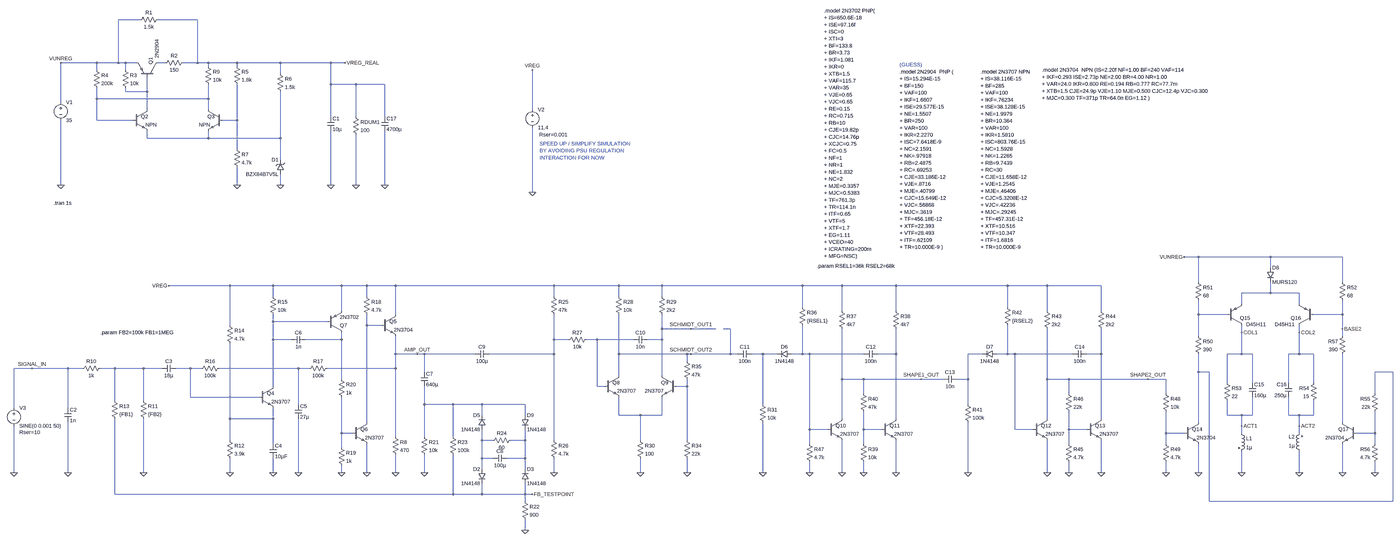
[diagram p0: schematic Balantron signal.asc, whole sheet]
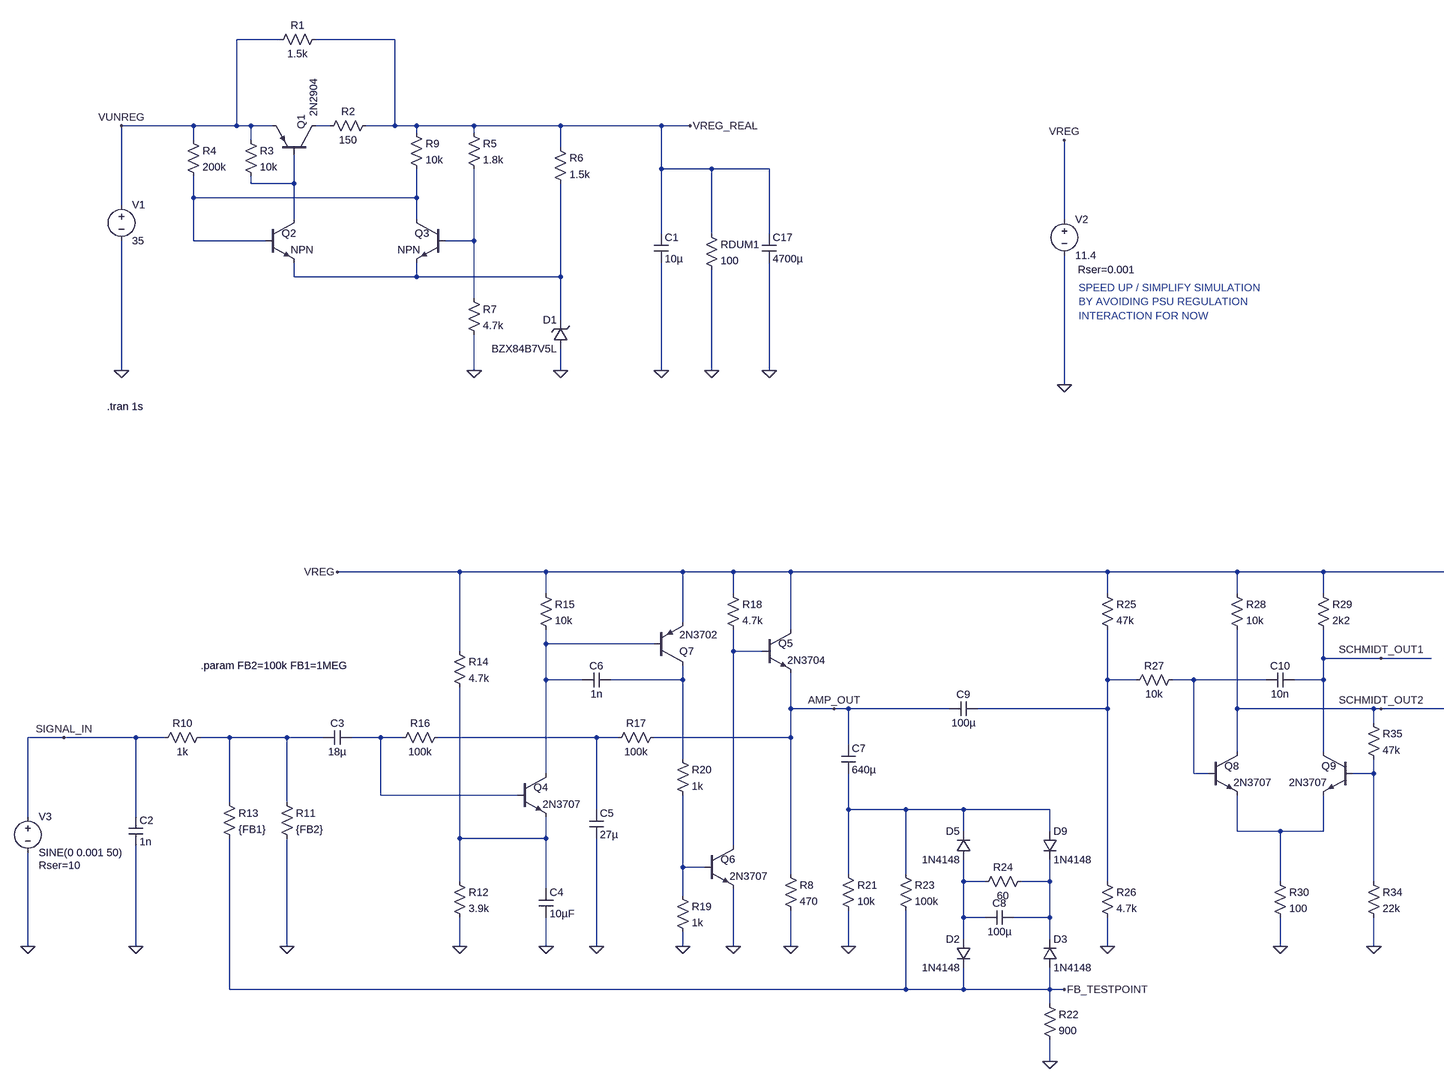
[diagram p1: schematic Balantron signal.asc, part, row 1 of 1, column 1 of 2]
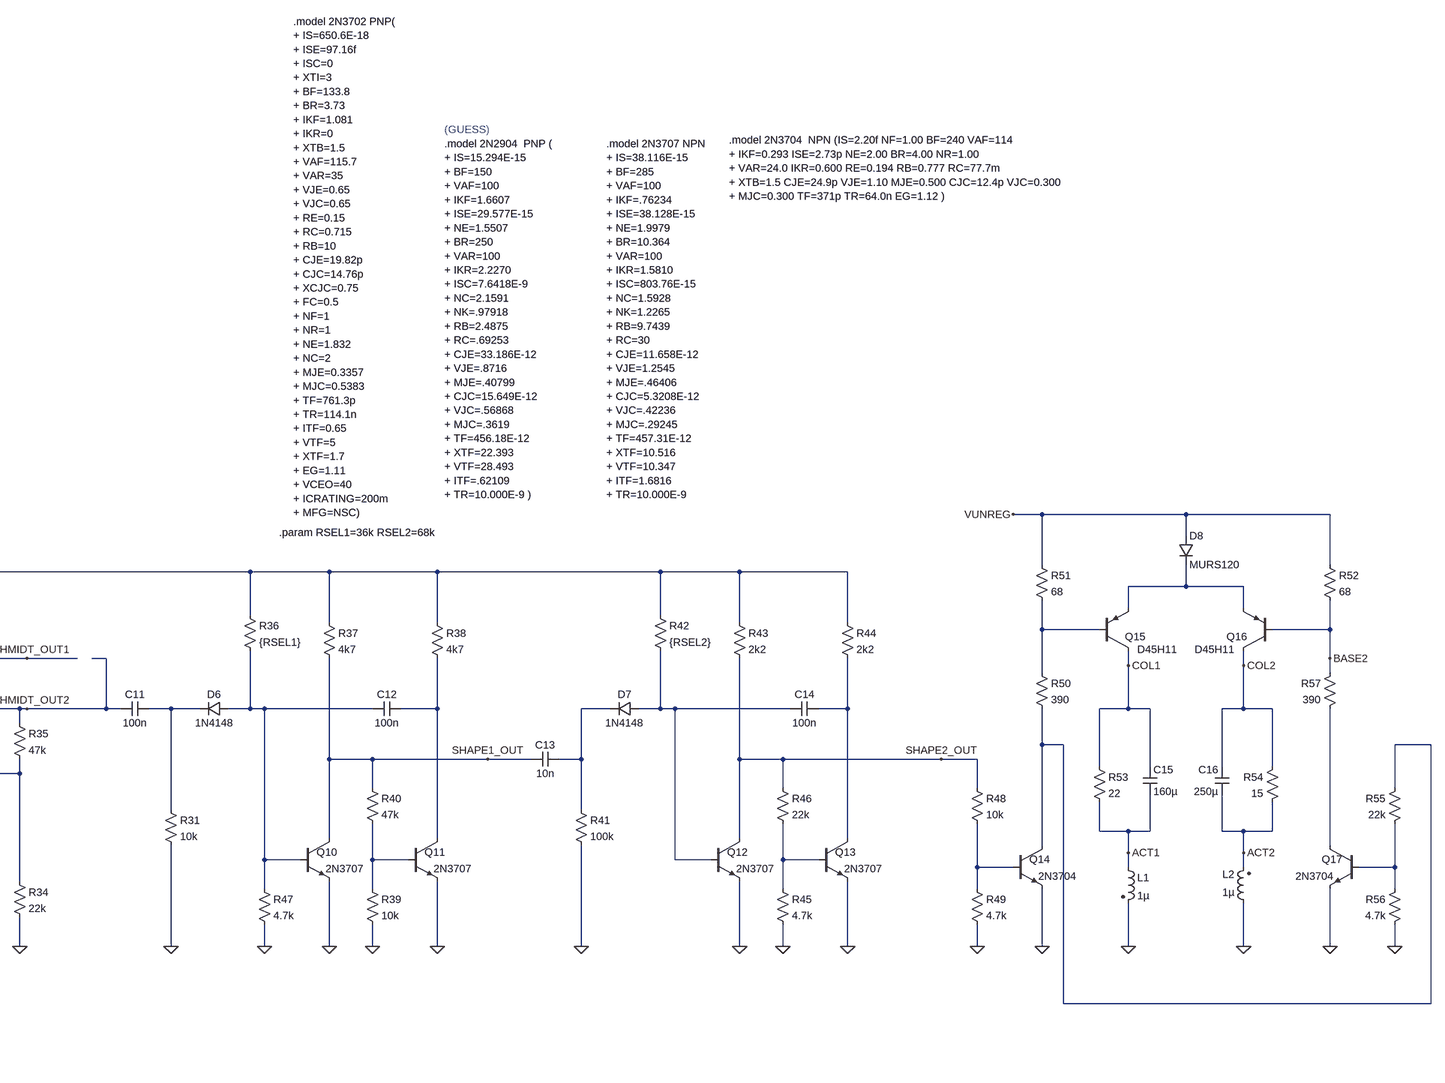
[diagram p2: schematic Balantron signal.asc, part, row 1 of 1, column 2 of 2]
Balantron signal.asc, the LTspice schematic file:
Version 4
SHEET 1 33348 1964
WIRE -432 -576 -528 -576
WIRE -176 -576 -352 -576
WIRE -624 -384 -784 -384
WIRE -528 -384 -528 -576
WIRE -528 -384 -624 -384
WIRE -496 -384 -528 -384
WIRE -448 -384 -496 -384
WIRE -320 -384 -352 -384
WIRE -176 -384 -176 -576
WIRE -176 -384 -240 -384
WIRE -128 -384 -176 -384
WIRE 0 -384 -128 -384
WIRE 192 -384 0 -384
WIRE 416 -384 192 -384
WIRE 480 -384 416 -384
WIRE -128 -368 -128 -384
WIRE 0 -368 0 -384
WIRE -624 -352 -624 -384
WIRE -496 -352 -496 -384
WIRE 192 -336 192 -384
WIRE 416 -288 416 -384
WIRE 528 -288 416 -288
WIRE 656 -288 528 -288
WIRE -496 -256 -496 -272
WIRE -400 -256 -400 -320
WIRE -400 -256 -496 -256
WIRE -624 -224 -624 -272
WIRE -128 -224 -128 -288
WIRE -128 -224 -624 -224
WIRE -784 -208 -784 -384
WIRE -400 -176 -400 -256
WIRE -128 -176 -128 -224
WIRE 1312 -176 1312 -352
WIRE 416 -144 416 -288
WIRE 528 -144 528 -288
WIRE 656 -144 656 -288
WIRE -624 -128 -624 -224
WIRE -464 -128 -624 -128
WIRE 0 -128 0 -288
WIRE 0 -128 -64 -128
WIRE -400 -48 -400 -80
WIRE -128 -48 -128 -80
WIRE -128 -48 -400 -48
WIRE 192 -48 192 -256
WIRE 192 -48 -128 -48
WIRE 0 0 0 -128
WIRE 192 48 192 -48
WIRE -784 160 -784 -128
WIRE 0 160 0 80
WIRE 192 160 192 112
WIRE 416 160 416 -80
WIRE 528 160 528 -64
WIRE 656 160 656 -80
WIRE 1312 192 1312 -96
WIRE 4272 480 4208 480
WIRE 4592 480 4272 480
WIRE 4912 480 4592 480
WIRE 4592 528 4592 480
WIRE 4272 592 4272 480
WIRE 4912 592 4912 480
WIRE -32 608 -304 608
WIRE 160 608 -32 608
WIRE 464 608 160 608
WIRE 576 608 464 608
WIRE 704 608 576 608
WIRE 1408 608 704 608
WIRE 1696 608 1408 608
WIRE 1888 608 1696 608
WIRE 2512 608 1888 608
WIRE 2688 608 2512 608
WIRE 2928 608 2688 608
WIRE 3424 608 2928 608
WIRE 3600 608 3424 608
WIRE 3840 608 3600 608
WIRE 4592 640 4592 592
WIRE 4592 640 4464 640
WIRE 4720 640 4592 640
WIRE 160 656 160 608
WIRE 576 656 576 608
WIRE 1408 656 1408 608
WIRE 1696 656 1696 608
WIRE 1888 656 1888 608
WIRE 4464 688 4464 640
WIRE 4720 688 4720 640
WIRE 2512 704 2512 608
WIRE 3424 704 3424 608
WIRE 464 720 464 608
WIRE 2688 720 2688 608
WIRE 2928 720 2928 608
WIRE 3600 720 3600 608
WIRE 3840 720 3840 608
WIRE 704 736 704 608
WIRE 4272 736 4272 672
WIRE 4400 736 4272 736
WIRE 4912 736 4912 672
WIRE 4912 736 4784 736
WIRE 160 768 160 736
WIRE 400 768 160 768
WIRE -32 784 -32 608
WIRE 576 784 576 736
WIRE 640 784 576 784
WIRE 1888 800 1888 736
WIRE 2016 800 1888 800
WIRE 2128 800 2016 800
WIRE 2192 800 2160 800
WIRE 4912 800 4912 736
WIRE 4464 816 4464 784
WIRE 4720 816 4720 784
WIRE 4272 832 4272 736
WIRE 4912 832 4912 800
WIRE 160 848 160 768
WIRE 240 848 160 848
WIRE 464 848 464 816
WIRE 464 848 304 848
WIRE 1408 848 1408 736
WIRE 1472 848 1408 848
WIRE 1600 848 1552 848
WIRE 1760 848 1600 848
WIRE 1888 848 1888 800
WIRE 1888 848 1824 848
WIRE 704 912 704 832
WIRE 800 912 704 912
WIRE 832 912 800 912
WIRE 1056 912 832 912
WIRE 1408 912 1408 848
WIRE 1408 912 1120 912
WIRE 1696 912 1696 736
WIRE 2000 912 1696 912
WIRE 2016 912 2000 912
WIRE 2192 912 2192 800
WIRE 2192 912 2016 912
WIRE 2224 912 2192 912
WIRE 2336 912 2288 912
WIRE 2400 912 2336 912
WIRE 2512 912 2512 784
WIRE 2512 912 2464 912
WIRE 2544 912 2512 912
WIRE 2784 912 2544 912
WIRE 2928 912 2928 800
WIRE 2928 912 2848 912
WIRE 3312 912 3248 912
WIRE 3424 912 3424 784
WIRE 3424 912 3376 912
WIRE 3456 912 3424 912
WIRE 3712 912 3456 912
WIRE 3840 912 3840 800
WIRE 3840 912 3776 912
WIRE 4464 912 4464 816
WIRE 4464 912 4400 912
WIRE 4512 912 4464 912
WIRE 4720 912 4720 816
WIRE 4720 912 4672 912
WIRE 4784 912 4720 912
WIRE 2000 944 2000 912
WIRE -912 976 -992 976
WIRE -752 976 -912 976
WIRE -688 976 -752 976
WIRE -544 976 -608 976
WIRE -416 976 -544 976
WIRE -336 976 -416 976
WIRE -208 976 -272 976
WIRE -160 976 -208 976
WIRE 272 976 -80 976
WIRE 320 976 272 976
WIRE 704 976 704 912
WIRE 704 976 400 976
WIRE 832 992 832 912
WIRE 4272 992 4272 912
WIRE 4320 992 4272 992
WIRE 5136 992 5056 992
WIRE 1696 1008 1696 912
WIRE 1888 1008 1888 848
WIRE 464 1024 464 848
WIRE 2688 1024 2688 800
WIRE 2784 1024 2688 1024
WIRE 3040 1024 2784 1024
WIRE 3136 1024 3040 1024
WIRE 3248 1024 3248 912
WIRE 3248 1024 3200 1024
WIRE 3600 1024 3600 800
WIRE 3696 1024 3600 1024
WIRE 4048 1024 3696 1024
WIRE 4128 1024 4048 1024
WIRE 4400 1040 4400 912
WIRE 4512 1040 4512 912
WIRE 4672 1040 4672 912
WIRE 4784 1040 4784 912
WIRE 160 1056 160 848
WIRE 1600 1056 1600 848
WIRE 1632 1056 1600 1056
WIRE 2000 1056 2000 1024
WIRE 2000 1056 1952 1056
WIRE 2784 1088 2784 1024
WIRE 3696 1088 3696 1024
WIRE 4128 1088 4128 1024
WIRE 5056 1088 5056 992
WIRE -208 1104 -208 976
WIRE 96 1104 -208 1104
WIRE -544 1120 -544 976
WIRE -416 1120 -416 976
WIRE 272 1136 272 976
WIRE 832 1136 832 1056
WIRE 960 1136 832 1136
WIRE 1088 1136 960 1136
WIRE 1280 1136 1088 1136
WIRE 2336 1136 2336 912
WIRE 3248 1136 3248 1024
WIRE -992 1152 -992 976
WIRE -752 1152 -752 976
WIRE 1088 1184 1088 1136
WIRE 1280 1184 1280 1136
WIRE 1696 1184 1696 1104
WIRE 1792 1184 1696 1184
WIRE 1888 1184 1888 1104
WIRE 1888 1184 1792 1184
WIRE 4400 1184 4400 1120
WIRE 4464 1184 4400 1184
WIRE 4512 1184 4512 1104
WIRE 4512 1184 4464 1184
WIRE 4672 1184 4672 1104
WIRE 4720 1184 4672 1184
WIRE 4784 1184 4784 1120
WIRE 4784 1184 4720 1184
WIRE -32 1200 -32 864
WIRE 160 1200 160 1152
WIRE 160 1200 -32 1200
WIRE 2688 1200 2688 1024
WIRE 2928 1200 2928 912
WIRE 3600 1200 3600 1024
WIRE 3840 1200 3840 912
WIRE 576 1216 576 784
WIRE 4272 1216 4272 992
WIRE 4912 1216 4912 912
WIRE 4464 1232 4464 1184
WIRE 4720 1232 4720 1184
WIRE 2544 1248 2544 912
WIRE 2624 1248 2544 1248
WIRE 2784 1248 2784 1168
WIRE 2864 1248 2784 1248
WIRE 3456 1248 3456 912
WIRE 3536 1248 3456 1248
WIRE 3696 1248 3696 1168
WIRE 3776 1248 3696 1248
WIRE 464 1264 464 1104
WIRE 512 1264 464 1264
WIRE 4128 1264 4128 1168
WIRE 4208 1264 4128 1264
WIRE 4464 1264 4464 1232
WIRE 4720 1264 4720 1232
WIRE 5056 1264 5056 1168
WIRE 5056 1264 4976 1264
WIRE 704 1280 704 976
WIRE 832 1280 832 1136
WIRE 960 1280 960 1136
WIRE -32 1296 -32 1200
WIRE 1088 1296 1088 1248
WIRE 1136 1296 1088 1296
WIRE 1280 1296 1280 1248
WIRE 1280 1296 1216 1296
WIRE 1408 1296 1408 912
WIRE 1792 1296 1792 1184
WIRE 2000 1296 2000 1056
WIRE 160 1312 160 1200
WIRE 2544 1312 2544 1248
WIRE 2784 1312 2784 1248
WIRE 3696 1312 3696 1248
WIRE 4128 1312 4128 1264
WIRE 5056 1312 5056 1264
WIRE 464 1328 464 1264
WIRE 1088 1376 1088 1296
WIRE 1136 1376 1088 1376
WIRE 1280 1376 1280 1296
WIRE 1280 1376 1200 1376
WIRE 1088 1424 1088 1376
WIRE 1280 1424 1280 1376
WIRE -992 1440 -992 1232
WIRE -752 1440 -752 1216
WIRE -416 1440 -416 1200
WIRE -32 1440 -32 1376
WIRE 160 1440 160 1376
WIRE 272 1440 272 1200
WIRE 464 1440 464 1408
WIRE 576 1440 576 1312
WIRE 704 1440 704 1360
WIRE 832 1440 832 1360
WIRE 1408 1440 1408 1376
WIRE 1792 1440 1792 1376
WIRE 2000 1440 2000 1376
WIRE 2336 1440 2336 1216
WIRE 2544 1440 2544 1392
WIRE 2688 1440 2688 1296
WIRE 2784 1440 2784 1392
WIRE 2928 1440 2928 1296
WIRE 3248 1440 3248 1216
WIRE 3600 1440 3600 1296
WIRE 3696 1440 3696 1392
WIRE 3840 1440 3840 1296
WIRE 4128 1440 4128 1392
WIRE 4272 1440 4272 1312
WIRE 4464 1440 4464 1344
WIRE 4720 1440 4720 1344
WIRE 4912 1440 4912 1312
WIRE 5056 1440 5056 1392
WIRE -544 1536 -544 1200
WIRE 960 1536 960 1360
WIRE 960 1536 -544 1536
WIRE 1088 1536 1088 1488
WIRE 1088 1536 960 1536
WIRE 1280 1536 1280 1488
WIRE 1280 1536 1088 1536
WIRE 1312 1536 1280 1536
WIRE 1280 1568 1280 1536
WIRE 4320 1568 4320 992
WIRE 5136 1568 5136 992
WIRE 5136 1568 4320 1568
WIRE 1280 1696 1280 1648
FLAG -784 160 0
FLAG 416 160 0
FLAG -784 -384 VUNREG
FLAG 0 160 0
FLAG 192 160 0
FLAG 656 160 0
FLAG -992 1440 0
FLAG -752 1440 0
FLAG -416 1440 0
FLAG 1312 1536 FB_TESTPOINT
FLAG -32 1440 0
FLAG -304 608 VREG
FLAG 160 1440 0
FLAG 272 1440 0
FLAG 576 1440 0
FLAG 464 1440 0
FLAG 1408 1440 0
FLAG 1792 1440 0
FLAG 2336 1440 0
FLAG 2000 1440 0
FLAG 2784 1440 0
FLAG 2688 1440 0
FLAG 2928 1440 0
FLAG 3248 1440 0
FLAG 3696 1440 0
FLAG 3600 1440 0
FLAG 3840 1440 0
FLAG 2544 1440 0
FLAG 4128 1440 0
FLAG 4272 1440 0
FLAG 4208 480 VUNREG
FLAG 4464 1440 0
FLAG 4720 1440 0
FLAG 5056 1440 0
FLAG 4912 1440 0
FLAG 4912 800 BASE2
FLAG 4464 816 COL1
FLAG 4720 816 COL2
FLAG 4464 1232 ACT1
FLAG 4720 1232 ACT2
FLAG -912 976 SIGNAL_IN
FLAG 480 -384 VREG_REAL
FLAG 2016 800 SCHMIDT_OUT1
FLAG 2016 912 SCHMIDT_OUT2
FLAG 800 912 AMP_OUT
FLAG 3040 1024 SHAPE1_OUT
FLAG 4048 1024 SHAPE2_OUT
FLAG 1312 192 0
FLAG 1312 -352 VREG
FLAG 528 160 0
FLAG 1280 1696 0
FLAG 832 1440 0
FLAG 704 1440 0
SYMBOL pnp -352 -320 M270
WINDOW 3 84 4 Left 2
SYMATTR Value 2N2904
SYMATTR InstName Q1
SYMBOL voltage -784 -224 R0
WINDOW 123 0 0 Left 2
WINDOW 39 0 0 Left 2
SYMATTR InstName V1
SYMATTR Value 35
SYMBOL res -336 -592 R90
WINDOW 0 0 56 VBottom 2
WINDOW 3 32 56 VTop 2
SYMATTR InstName R1
SYMATTR Value 1.5k
SYMBOL res -224 -400 R90
WINDOW 0 0 56 VBottom 2
WINDOW 3 32 56 VTop 2
SYMATTR InstName R2
SYMATTR Value 150
SYMBOL cap 400 -144 R0
SYMATTR InstName C1
SYMATTR Value 10µ
SYMATTR SpiceLine Rser=0.01
SYMBOL res -512 -368 R0
SYMATTR InstName R3
SYMATTR Value 10k
SYMBOL res -640 -368 R0
SYMATTR InstName R4
SYMATTR Value 200k
SYMBOL res -16 -384 R0
SYMATTR InstName R5
SYMATTR Value 1.8k
SYMBOL res 176 -352 R0
SYMATTR InstName R6
SYMATTR Value 1.5k
SYMBOL res -16 -16 R0
SYMATTR InstName R7
SYMATTR Value 4.7k
SYMBOL npn -464 -176 R0
WINDOW 0 36 31 Left 2
SYMATTR InstName Q2
SYMBOL npn -64 -176 M0
WINDOW 0 36 31 Left 2
SYMATTR InstName Q3
SYMBOL zener 208 112 R180
WINDOW 0 24 64 Left 2
WINDOW 3 24 0 Left 2
SYMATTR InstName D1
SYMATTR Value BZX84B7V5L
SYMATTR Description Diode
SYMATTR Type diode
SYMBOL res -144 -384 R0
SYMATTR InstName R9
SYMATTR Value 10k
SYMBOL voltage -992 1136 R0
WINDOW 123 0 0 Left 2
WINDOW 39 24 124 Left 2
SYMATTR SpiceLine Rser=10
SYMATTR InstName V3
SYMATTR Value SINE(0 0.001 50)
SYMBOL cap -768 1152 R0
SYMATTR InstName C2
SYMATTR Value 1n
SYMBOL res -592 960 R90
WINDOW 0 0 56 VBottom 2
WINDOW 3 32 56 VTop 2
SYMATTR InstName R10
SYMATTR Value 1k
SYMBOL res -560 1104 R0
SYMATTR InstName R13
SYMATTR Value {FB1}
SYMBOL res -432 1104 R0
SYMATTR InstName R11
SYMATTR Value {FB2}
SYMBOL cap -336 992 R270
WINDOW 0 32 32 VTop 2
WINDOW 3 0 32 VBottom 2
WINDOW 39 -28 32 VBottom 2
SYMATTR InstName C3
SYMATTR Value 18µ
SYMBOL res -48 1280 R0
SYMATTR InstName R12
SYMATTR Value 3.9k
SYMBOL res -48 768 R0
SYMATTR InstName R14
SYMATTR Value 4.7k
SYMBOL cap 144 1312 R0
WINDOW 39 24 84 Left 2
SYMATTR InstName C4
SYMATTR Value 10µF
SYMBOL npn 96 1056 R0
WINDOW 0 36 31 Left 2
SYMATTR InstName Q4
SYMATTR Value 2N3707
SYMBOL res 144 640 R0
SYMATTR InstName R15
SYMATTR Value 10k
SYMBOL res -64 960 R90
WINDOW 0 0 56 VBottom 2
WINDOW 3 32 56 VTop 2
SYMATTR InstName R16
SYMATTR Value 100k
SYMBOL cap 256 1136 R0
SYMATTR InstName C5
SYMATTR Value 27µ
SYMBOL res 416 960 R90
WINDOW 0 0 56 VBottom 2
WINDOW 3 32 56 VTop 2
SYMATTR InstName R17
SYMATTR Value 100k
SYMBOL npn 640 736 R0
WINDOW 0 36 31 Left 2
SYMATTR InstName Q5
SYMATTR Value 2N3704
SYMBOL res 560 640 R0
SYMATTR InstName R18
SYMATTR Value 4.7k
SYMBOL npn 512 1216 R0
WINDOW 0 36 31 Left 2
SYMATTR InstName Q6
SYMATTR Value 2N3707
SYMBOL res 448 1312 R0
SYMATTR InstName R19
SYMATTR Value 1k
SYMBOL res 448 1008 R0
SYMATTR InstName R20
SYMATTR Value 1k
SYMBOL pnp 400 816 M180
SYMATTR InstName Q7
SYMATTR Value 2N3702
SYMBOL cap 240 864 R270
WINDOW 0 32 32 VTop 2
WINDOW 3 0 32 VBottom 2
SYMATTR InstName C6
SYMATTR Value 1n
SYMBOL res 816 1264 R0
SYMATTR InstName R21
SYMATTR Value 10k
SYMBOL cap 816 992 R0
WINDOW 39 24 84 Left 2
SYMATTR InstName C7
SYMATTR Value 640µ
SYMBOL diode 1104 1424 M0
SYMATTR InstName D2
SYMATTR Value 1N4148
SYMBOL diode 1104 1248 R180
WINDOW 0 24 64 Left 2
WINDOW 3 24 0 Left 2
SYMATTR InstName D5
SYMATTR Value 1N4148
SYMBOL res 1264 1552 R0
SYMATTR InstName R22
SYMATTR Value 900
SYMBOL res 944 1264 R0
SYMATTR InstName R23
SYMATTR Value 100k
SYMBOL cap 1136 1392 R270
WINDOW 0 32 32 VTop 2
WINDOW 3 0 32 VBottom 2
SYMATTR InstName C8
SYMATTR Value 100µ
SYMBOL res 1232 1280 R90
WINDOW 0 0 56 VBottom 2
WINDOW 3 32 56 VTop 2
SYMATTR InstName R24
SYMATTR Value 60
SYMBOL cap 1056 928 R270
WINDOW 0 32 32 VTop 2
WINDOW 3 0 32 VBottom 2
WINDOW 39 -28 32 VBottom 2
SYMATTR InstName C9
SYMATTR Value 100µ
SYMBOL res 1392 640 R0
SYMATTR InstName R25
SYMATTR Value 47k
SYMBOL res 1392 1280 R0
SYMATTR InstName R26
SYMATTR Value 4.7k
SYMBOL res 1568 832 R90
WINDOW 0 0 56 VBottom 2
WINDOW 3 32 56 VTop 2
SYMATTR InstName R27
SYMATTR Value 10k
SYMBOL res 1680 640 R0
SYMATTR InstName R28
SYMATTR Value 10k
SYMBOL res 1872 640 R0
SYMATTR InstName R29
SYMATTR Value 2k2
SYMBOL cap 1760 864 R270
WINDOW 0 32 32 VTop 2
WINDOW 3 0 32 VBottom 2
SYMATTR InstName C10
SYMATTR Value 10n
SYMBOL npn 1632 1008 R0
WINDOW 0 36 31 Left 2
SYMATTR InstName Q8
SYMATTR Value 2N3707
SYMBOL npn 1952 1008 M0
WINDOW 0 36 31 Left 2
SYMATTR InstName Q9
SYMATTR Value 2N3707
SYMBOL res 1776 1280 R0
SYMATTR InstName R30
SYMATTR Value 100
SYMBOL res 2320 1120 R0
SYMATTR InstName R31
SYMATTR Value 10k
SYMBOL diode 2464 896 R90
WINDOW 0 0 32 VBottom 2
WINDOW 3 32 32 VTop 2
SYMATTR InstName D6
SYMATTR Value 1N4148
SYMBOL cap 2224 928 R270
WINDOW 0 32 32 VTop 2
WINDOW 3 0 32 VBottom 2
SYMATTR InstName C11
SYMATTR Value 100n
SYMBOL res 1984 1280 R0
SYMATTR InstName R34
SYMATTR Value 22k
SYMBOL res 1984 928 R0
SYMATTR InstName R35
SYMATTR Value 47k
SYMBOL res 2496 688 R0
SYMATTR InstName R36
SYMATTR Value {RSEL1}
SYMBOL npn 2624 1200 R0
WINDOW 0 36 31 Left 2
SYMATTR InstName Q10
SYMATTR Value 2N3707
SYMBOL cap 2784 928 R270
WINDOW 0 32 32 VTop 2
WINDOW 3 0 32 VBottom 2
SYMATTR InstName C12
SYMATTR Value 100n
SYMBOL res 2672 704 R0
SYMATTR InstName R37
SYMATTR Value 4k7
SYMBOL npn 2864 1200 R0
WINDOW 0 36 31 Left 2
SYMATTR InstName Q11
SYMATTR Value 2N3707
SYMBOL res 2912 704 R0
SYMATTR InstName R38
SYMATTR Value 4k7
SYMBOL res 2768 1296 R0
SYMATTR InstName R39
SYMATTR Value 10k
SYMBOL res 2768 1072 R0
SYMATTR InstName R40
SYMATTR Value 47k
SYMBOL res 3232 1120 R0
SYMATTR InstName R41
SYMATTR Value 100k
SYMBOL diode 3376 896 R90
WINDOW 0 0 32 VBottom 2
WINDOW 3 32 32 VTop 2
SYMATTR InstName D7
SYMATTR Value 1N4148
SYMBOL cap 3136 1040 R270
WINDOW 0 32 32 VTop 2
WINDOW 3 0 32 VBottom 2
SYMATTR InstName C13
SYMATTR Value 10n
SYMBOL res 3408 688 R0
SYMATTR InstName R42
SYMATTR Value {RSEL2}
SYMBOL npn 3536 1200 R0
WINDOW 0 36 31 Left 2
SYMATTR InstName Q12
SYMATTR Value 2N3707
SYMBOL cap 3712 928 R270
WINDOW 0 32 32 VTop 2
WINDOW 3 0 32 VBottom 2
SYMATTR InstName C14
SYMATTR Value 100n
SYMBOL res 3584 704 R0
SYMATTR InstName R43
SYMATTR Value 2k2
SYMBOL npn 3776 1200 R0
WINDOW 0 36 31 Left 2
SYMATTR InstName Q13
SYMATTR Value 2N3707
SYMBOL res 3824 704 R0
SYMATTR InstName R44
SYMATTR Value 2k2
SYMBOL res 3680 1296 R0
SYMATTR InstName R45
SYMATTR Value 4.7k
SYMBOL res 3680 1072 R0
SYMATTR InstName R46
SYMATTR Value 22k
SYMBOL res 2528 1296 R0
SYMATTR InstName R47
SYMATTR Value 4.7k
SYMBOL res 4112 1072 R0
SYMATTR InstName R48
SYMATTR Value 10k
SYMBOL res 4112 1296 R0
SYMATTR InstName R49
SYMATTR Value 4.7k
SYMBOL npn 4208 1216 R0
WINDOW 0 36 31 Left 2
SYMATTR InstName Q14
SYMATTR Value 2N3704
SYMBOL res 4256 816 R0
SYMATTR InstName R50
SYMATTR Value 390
SYMBOL res 4256 576 R0
SYMATTR InstName R51
SYMATTR Value 68
SYMBOL pnp 4400 784 M180
WINDOW 3 84 4 Left 2
SYMATTR Value D45H11
SYMATTR InstName Q15
SYMBOL pnp 4784 784 R180
WINDOW 3 84 4 Left 2
SYMATTR Value D45H11
SYMATTR InstName Q16
SYMBOL res 4896 576 R0
SYMATTR InstName R52
SYMATTR Value 68
SYMBOL diode 4576 528 R0
SYMATTR InstName D8
SYMATTR Value MURS120
SYMBOL res 4384 1024 R0
SYMATTR InstName R53
SYMATTR Value 22
SYMBOL cap 4496 1040 R0
SYMATTR InstName C15
SYMATTR Value 160µ
SYMATTR SpiceLine Rser=0.05
SYMBOL ind2 4448 1248 R0
SYMATTR InstName L1
SYMATTR Value 1µ
SYMATTR Type ind
SYMATTR SpiceLine Rser=4 Rpar=10
SYMBOL res 4800 1024 M0
SYMATTR InstName R54
SYMATTR Value 15
SYMBOL cap 4688 1040 M0
SYMATTR InstName C16
SYMATTR Value 250µ
SYMATTR SpiceLine Rser=0.05
SYMBOL ind2 4736 1360 R180
WINDOW 0 36 80 Left 2
WINDOW 3 36 40 Left 2
SYMATTR InstName L2
SYMATTR Value 1µ
SYMATTR Type ind
SYMATTR SpiceLine Rser=4 Rpar=10
SYMBOL res 5072 1072 M0
SYMATTR InstName R55
SYMATTR Value 22k
SYMBOL res 5072 1296 M0
SYMATTR InstName R56
SYMATTR Value 4.7k
SYMBOL npn 4976 1216 M0
WINDOW 0 36 31 Left 2
SYMATTR InstName Q17
SYMATTR Value 2N3704
SYMBOL res 4928 816 M0
SYMATTR InstName R57
SYMATTR Value 390
SYMBOL cap 640 -144 R0
SYMATTR InstName C17
SYMATTR Value 4700µ
SYMATTR SpiceLine Rser=0.05
SYMBOL voltage 1312 -192 R0
WINDOW 123 0 0 Left 2
WINDOW 39 30 128 Left 2
SYMATTR SpiceLine Rser=0.001
SYMATTR InstName V2
SYMATTR Value 11.4
SYMBOL res 512 -160 R0
SYMATTR InstName RDUM1
SYMATTR Value 100
SYMBOL diode 1264 1184 R0
SYMATTR InstName D9
SYMATTR Value 1N4148
SYMBOL diode 1264 1488 M180
WINDOW 0 24 64 Left 2
WINDOW 3 24 0 Left 2
SYMATTR InstName D3
SYMATTR Value 1N4148
SYMBOL res 688 1264 R0
SYMATTR InstName R8
SYMATTR Value 470
TEXT -816 240 Left 2 !.tran 1s
TEXT 2944 -344 Left 2 !.model 2N2904  PNP (\n+ IS=15.294E-15\n+ BF=150\n+ VAF=100\n+ IKF=1.6607\n+ ISE=29.577E-15\n+ NE=1.5507\n+ BR=250\n+ VAR=100\n+ IKR=2.2270\n+ ISC=7.6418E-9\n+ NC=2.1591\n+ NK=.97918\n+ RB=2.4875\n+ RC=.69253\n+ CJE=33.186E-12\n+ VJE=.8716\n+ MJE=.40799\n+ CJC=15.649E-12\n+ VJC=.56868\n+ MJC=.3619\n+ TF=456.18E-12\n+ XTF=22.393\n+ VTF=28.493\n+ ITF=.62109\n+ TR=10.000E-9 )
TEXT 2944 -376 Left 2 ;(GUESS)
TEXT -608 816 Left 2 !.param FB2=100k FB1=1MEG
TEXT 2576 520 Left 2 !.param RSEL1=36k RSEL2=68k
TEXT 1344 -24 Left 2 ;SPEED UP / SIMPLIFY SIMULATION\nBY AVOIDING PSU REGULATION\nINTERACTION FOR NOW
TEXT 3576 -352 Left 2 !.model 2N3704  NPN (IS=2.20f NF=1.00 BF=240 VAF=114\n+ IKF=0.293 ISE=2.73p NE=2.00 BR=4.00 NR=1.00\n+ VAR=24.0 IKR=0.600 RE=0.194 RB=0.777 RC=77.7m\n+ XTB=1.5 CJE=24.9p VJE=1.10 MJE=0.500 CJC=12.4p VJC=0.300\n+ MJC=0.300 TF=371p TR=64.0n EG=1.12 )
TEXT 3304 -344 Left 2 !.model 2N3707 NPN\n+ IS=38.116E-15\n+ BF=285\n+ VAF=100\n+ IKF=.76234\n+ ISE=38.128E-15\n+ NE=1.9979\n+ BR=10.364\n+ VAR=100\n+ IKR=1.5810\n+ ISC=803.76E-15\n+ NC=1.5928\n+ NK=1.2265\n+ RB=9.7439\n+ RC=30\n+ CJE=11.658E-12\n+ VJE=1.2545\n+ MJE=.46406\n+ CJC=5.3208E-12\n+ VJC=.42236\n+ MJC=.29245\n+ TF=457.31E-12\n+ XTF=10.516\n+ VTF=10.347\n+ ITF=1.6816\n+ TR=10.000E-9
TEXT 2608 -616 Left 2 !.model 2N3702 PNP(\n+ IS=650.6E-18\n+ ISE=97.16f\n+ ISC=0\n+ XTI=3\n+ BF=133.8\n+ BR=3.73\n+ IKF=1.081\n+ IKR=0\n+ XTB=1.5\n+ VAF=115.7\n+ VAR=35\n+ VJE=0.65\n+ VJC=0.65\n+ RE=0.15\n+ RC=0.715\n+ RB=10\n+ CJE=19.82p\n+ CJC=14.76p\n+ XCJC=0.75\n+ FC=0.5\n+ NF=1\n+ NR=1\n+ NE=1.832\n+ NC=2\n+ MJE=0.3357\n+ MJC=0.5383\n+ TF=761.3p\n+ TR=114.1n\n+ ITF=0.65\n+ VTF=5\n+ XTF=1.7\n+ EG=1.11\n+ VCEO=40\n+ ICRATING=200m\n+ MFG=NSC)

The netlist it stands for:
* Balantron signal.asc
Q1 N001 N002 VUNREG 0 2N2904
V1 VUNREG 0 35
R1 VREG_REAL VUNREG 1.5k
R2 VREG_REAL N001 150
C1 VREG_REAL 0 10µ Rser=0.01
R3 VUNREG N002 10k
R4 VUNREG N003 200k
R5 VREG_REAL N004 1.8k
R6 VREG_REAL N005 1.5k
R7 N004 0 4.7k
Q2 N002 N003 N005 0 NPN
Q3 N003 N004 N005 0 NPN
D1 0 N005 BZX84B7V5L
R9 VREG_REAL N003 10k
V3 SIGNAL_IN 0 SINE(0 0.001 50) Rser=10
C2 SIGNAL_IN 0 1n
R10 N019 SIGNAL_IN 1k
R13 N019 FB_TESTPOINT {FB1}
R11 N019 0 {FB2}
C3 N019 N020 18µ
R12 N026 0 3.9k
R14 VREG N026 4.7k
C4 N026 0 10µF
Q4 N008 N020 N026 0 2N3707
R15 VREG N008 10k
R16 N021 N020 100k
C5 N021 0 27µ
R17 AMP_OUT N021 100k
Q5 VREG N009 AMP_OUT 0 2N3704
R18 VREG N009 4.7k
Q6 N009 N030 0 0 2N3707
R19 N030 0 1k
R20 N010 N030 1k
Q7 N010 N008 VREG 0 2N3702
C6 N008 N010 1n
R21 N024 0 10k
C7 AMP_OUT N024 640µ
D2 N033 FB_TESTPOINT 1N4148
D5 N033 N024 1N4148
R22 FB_TESTPOINT 0 900
R23 N024 FB_TESTPOINT 100k
C8 N033 N034 100µ
R24 N034 N033 60
C9 AMP_OUT N011 100µ
R25 VREG N011 47k
R26 N011 0 4.7k
R27 N012 N011 10k
R28 VREG SCHMIDT_OUT2 10k
R29 VREG SCHMIDT_OUT1 2k2
C10 N012 SCHMIDT_OUT1 10n
Q8 SCHMIDT_OUT2 N012 N025 0 2N3707
Q9 SCHMIDT_OUT1 N023 N025 0 2N3707
R30 N025 0 100
R31 N013 0 10k
D6 N014 N013 1N4148
C11 SCHMIDT_OUT2 N013 100n
R34 N023 0 22k
R35 SCHMIDT_OUT2 N023 47k
R36 VREG N014 {RSEL1}
Q10 SHAPE1_OUT N014 0 0 2N3707
C12 N014 N015 100n
R37 VREG SHAPE1_OUT 4k7
Q11 N015 N028 0 0 2N3707
R38 VREG N015 4k7
R39 N028 0 10k
R40 SHAPE1_OUT N028 47k
R41 N016 0 100k
D7 N017 N016 1N4148
C13 SHAPE1_OUT N016 10n
R42 VREG N017 {RSEL2}
Q12 SHAPE2_OUT N017 0 0 2N3707
C14 N017 N018 100n
R43 VREG SHAPE2_OUT 2k2
Q13 N018 N029 0 0 2N3707
R44 VREG N018 2k2
R45 N029 0 4.7k
R46 SHAPE2_OUT N029 22k
R47 N014 0 4.7k
R48 SHAPE2_OUT N031 10k
R49 N031 0 4.7k
Q14 N022 N031 0 0 2N3704
R50 N007 N022 390
R51 VUNREG N007 68
Q15 COL1 N007 N006 0 D45H11
Q16 COL2 BASE2 N006 0 D45H11
R52 VUNREG BASE2 68
D8 VUNREG N006 MURS120
R53 COL1 ACT1 22
C15 COL1 ACT1 160µ Rser=0.05
L1 ACT1 0 1µ Rser=4 Rpar=10
R54 COL2 ACT2 15
C16 COL2 ACT2 250µ Rser=0.05
L2 0 ACT2 1µ Rser=4 Rpar=10
R55 N022 N032 22k
R56 N032 0 4.7k
Q17 N027 N032 0 0 2N3704
R57 BASE2 N027 390
C17 VREG_REAL 0 4700µ Rser=0.05
V2 VREG 0 11.4 Rser=0.001
RDUM1 VREG_REAL 0 100
D9 N024 N034 1N4148
D3 FB_TESTPOINT N034 1N4148
R8 AMP_OUT 0 470
.model D D
.lib standard.dio
.model NPN NPN
.model PNP PNP
.lib standard.bjt
.tran 1s
.model 2N2904  PNP (
+ IS=15.294E-15
+ BF=150
+ VAF=100
+ IKF=1.6607
+ ISE=29.577E-15
+ NE=1.5507
+ BR=250
+ VAR=100
+ IKR=2.2270
+ ISC=7.6418E-9
+ NC=2.1591
+ NK=.97918
+ RB=2.4875
+ RC=.69253
+ CJE=33.186E-12
+ VJE=.8716
+ MJE=.40799
+ CJC=15.649E-12
+ VJC=.56868
+ MJC=.3619
+ TF=456.18E-12
+ XTF=22.393
+ VTF=28.493
+ ITF=.62109
+ TR=10.000E-9 )
* (GUESS)
.param FB2=100k FB1=1MEG
.param RSEL1=36k RSEL2=68k
* SPEED UP / SIMPLIFY SIMULATION
* BY AVOIDING PSU REGULATION
* INTERACTION FOR NOW
.model 2N3704  NPN (IS=2.20f NF=1.00 BF=240 VAF=114
+ IKF=0.293 ISE=2.73p NE=2.00 BR=4.00 NR=1.00
+ VAR=24.0 IKR=0.600 RE=0.194 RB=0.777 RC=77.7m
+ XTB=1.5 CJE=24.9p VJE=1.10 MJE=0.500 CJC=12.4p VJC=0.300
+ MJC=0.300 TF=371p TR=64.0n EG=1.12 )
.model 2N3707 NPN
+ IS=38.116E-15
+ BF=285
+ VAF=100
+ IKF=.76234
+ ISE=38.128E-15
+ NE=1.9979
+ BR=10.364
+ VAR=100
+ IKR=1.5810
+ ISC=803.76E-15
+ NC=1.5928
+ NK=1.2265
+ RB=9.7439
+ RC=30
+ CJE=11.658E-12
+ VJE=1.2545
+ MJE=.46406
+ CJC=5.3208E-12
+ VJC=.42236
+ MJC=.29245
+ TF=457.31E-12
+ XTF=10.516
+ VTF=10.347
+ ITF=1.6816
+ TR=10.000E-9
.model 2N3702 PNP(
+ IS=650.6E-18
+ ISE=97.16f
+ ISC=0
+ XTI=3
+ BF=133.8
+ BR=3.73
+ IKF=1.081
+ IKR=0
+ XTB=1.5
+ VAF=115.7
+ VAR=35
+ VJE=0.65
+ VJC=0.65
+ RE=0.15
+ RC=0.715
+ RB=10
+ CJE=19.82p
+ CJC=14.76p
+ XCJC=0.75
+ FC=0.5
+ NF=1
+ NR=1
+ NE=1.832
+ NC=2
+ MJE=0.3357
+ MJC=0.5383
+ TF=761.3p
+ TR=114.1n
+ ITF=0.65
+ VTF=5
+ XTF=1.7
+ EG=1.11
+ VCEO=40
+ ICRATING=200m
+ MFG=NSC)
.backanno
.end